# Altium schematic sheet DigitalVoltage_PowerSupply.SchDoc
size A4; CompanyName: Technische Hochschule Nürnberg Georg Simon Ohm; Address1: Fürther Straße 250; Address2: 90429 Nürnberg; Address3: GERMANY; CompanyName2: Institut ELSYS
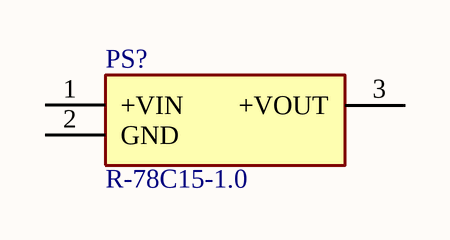
[diagram p0: DigitalVoltage_PowerSupply.SchDoc]

## Parts
PS?  R-78C15-1.0  [R78C1510]

## Nets

Not connected (* = marked no-connect by the designer): PS? 1(+VIN) 2(GND) 3(+VOUT)

## Notes on the sheet
- Title
- Size:
- Date:
- A4
- Revision:
- Time:
- Sheet
- of
- Author:
- Project:

## Library data of the parts
PS? = R-78C15-1.0: Power Supply; Manufacturer_Name: RECOM Power; Datasheet Link: https://www.recom-power.com/pdf/Innoline/R-78Cxx-1.0.pdf; Height: 10.9mm; Manufacturer_Part_Number: R-78C15-1.0; Mouser Part Number: 919-R-78C15-1.0; Mouser Price/Stock: https://www.mouser.com/Search/Refine.aspx?Keyword=919-R-78C15-1.0; RS Part Number: 7398307P; RS Price/Stock: http://uk.rs-online.com/web/p/products/7398307P